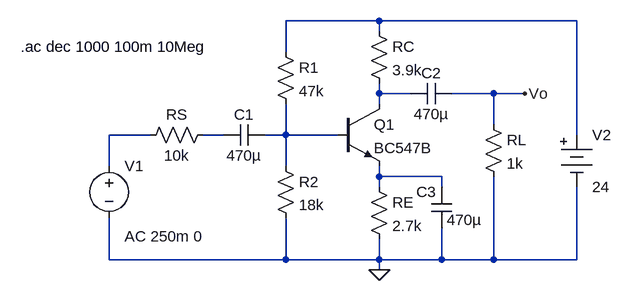
[diagram p0: schematic AMPfrec.asc]
AMPfrec.asc, the LTspice schematic file:
Version 4
SHEET 1 880 680
WIRE 32 -48 -112 -48
WIRE 336 -48 32 -48
WIRE 32 -32 32 -48
WIRE -112 0 -112 -48
WIRE 32 64 32 48
WIRE 80 64 32 64
WIRE 208 64 144 64
WIRE 256 64 208 64
WIRE 32 80 32 64
WIRE 208 112 208 64
WIRE -320 128 -384 128
WIRE -208 128 -240 128
WIRE -112 128 -112 80
WIRE -112 128 -144 128
WIRE -32 128 -112 128
WIRE 336 128 336 -48
WIRE -384 176 -384 128
WIRE -112 176 -112 128
WIRE 32 192 32 176
WIRE 128 192 32 192
WIRE 32 208 32 192
WIRE 128 208 128 192
WIRE -384 320 -384 256
WIRE -112 320 -112 256
WIRE -112 320 -384 320
WIRE 32 320 32 288
WIRE 32 320 -112 320
WIRE 128 320 128 272
WIRE 128 320 32 320
WIRE 208 320 208 192
WIRE 208 320 128 320
WIRE 336 320 336 208
WIRE 336 320 208 320
WIRE 32 336 32 320
FLAG 32 336 0
FLAG 256 64 Vo
SYMBOL voltage -384 160 R0
WINDOW 123 24 124 Left 2
WINDOW 39 0 0 Left 0
SYMATTR Value2 AC 250m 0
SYMATTR InstName V1
SYMATTR Value ""
SYMBOL res -224 112 R90
WINDOW 0 0 56 VBottom 2
WINDOW 3 32 56 VTop 2
SYMATTR InstName RS
SYMATTR Value 10k
SYMBOL cap -144 112 R90
WINDOW 0 0 32 VBottom 2
WINDOW 3 32 32 VTop 2
SYMATTR InstName C1
SYMATTR Value 470µ
SYMBOL res -128 -16 R0
SYMATTR InstName R1
SYMATTR Value 47k
SYMBOL res -128 160 R0
SYMATTR InstName R2
SYMATTR Value 18k
SYMBOL npn -32 80 R0
SYMATTR InstName Q1
SYMATTR Value BC547B
SYMBOL res 16 -48 R0
SYMATTR InstName RC
SYMATTR Value 3.9k
SYMBOL res 16 192 R0
SYMATTR InstName RE
SYMATTR Value 2.7k
SYMBOL cap 144 48 R90
WINDOW 0 0 32 VBottom 2
WINDOW 3 32 32 VTop 2
SYMATTR InstName C2
SYMATTR Value 470µ
SYMBOL cap 144 272 R180
WINDOW 0 24 56 Left 2
WINDOW 3 -46 13 Left 2
SYMATTR InstName C3
SYMATTR Value 470µ
SYMBOL Misc\\battery 336 112 R0
SYMATTR InstName V2
SYMATTR Value 24
SYMBOL res 192 96 R0
SYMATTR InstName RL
SYMATTR Value 1k
TEXT -520 -8 Left 2 !.ac dec 1000 100m 10Meg

The netlist it stands for:
* AMPfrec.asc
V1 N003 0 AC 250m 0
RS N004 N003 10k
C1 N005 N004 470µ
R1 N001 N005 47k
R2 N005 0 18k
Q1 N002 N005 N006 0 BC547B
RC N001 N002 3.9k
RE N006 0 2.7k
C2 Vo N002 470µ
C3 0 N006 470µ
V2 N001 0 24
RL Vo 0 1k
.model NPN NPN
.model PNP PNP
.lib standard.bjt
.ac dec 1000 100m 10Meg
.backanno
.end